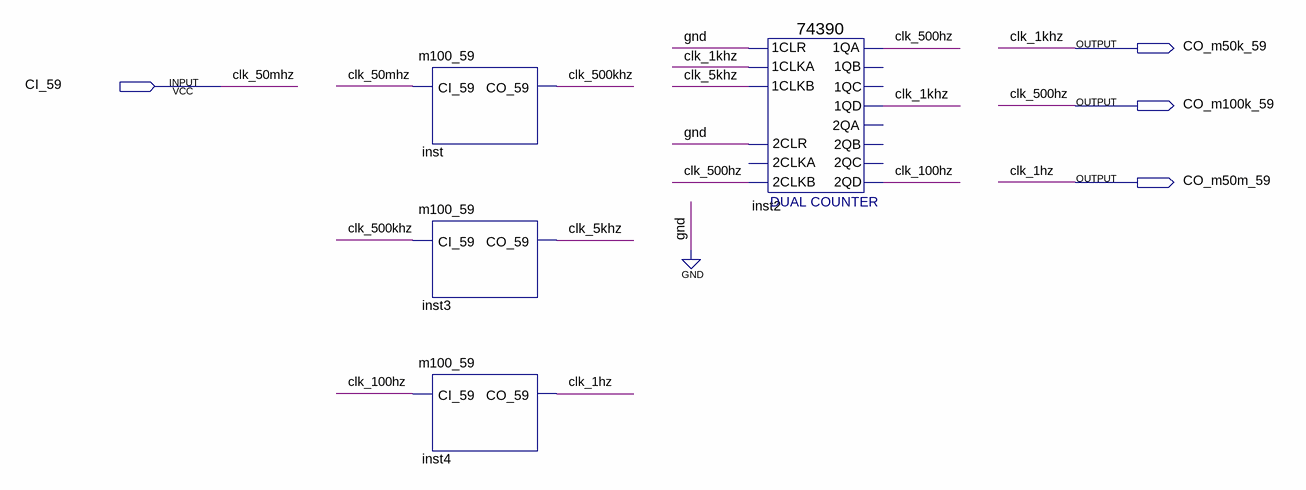
[diagram p0: schematic sheet]
// Quartus schematic fre_div_59.bdf as structural Verilog: 4 symbols, 4 pins
module fre_div_59 (
  input  CI_59,
  output CO_m50k_59,
  output CO_m100k_59,
  output CO_m50m_59
);

  wire clk_5khz, clk_100hz, clk_500khz;

  m100_59 inst (.CI_59(CI_59), .CO_59(clk_500khz));
  m100_59 inst3 (.CI_59(clk_500khz), .CO_59(clk_5khz));
  m100_59 inst4 (.CI_59(clk_100hz), .CO_59(CO_m50m_59));
  \74390  inst2 (
    .\2CLR (1'b0), .\2CLKB (CO_m100k_59), .\1CLR (1'b0), .\1CLKA (CO_m50k_59), .\1CLKB (clk_5khz),
    .\1QA (CO_m100k_59), .\1QD (CO_m50k_59), .\2QD (clk_100hz));  // open: 2CLKA, 1QB, 1QC, 2QA, 2QB, 2QC

  // Other names for the same wires on the sheet: clk_1hz = CO_m50m_59; clk_1khz = CO_m50k_59; clk_50mhz = CI_59;
  //   clk_500hz = CO_m100k_59
endmodule
